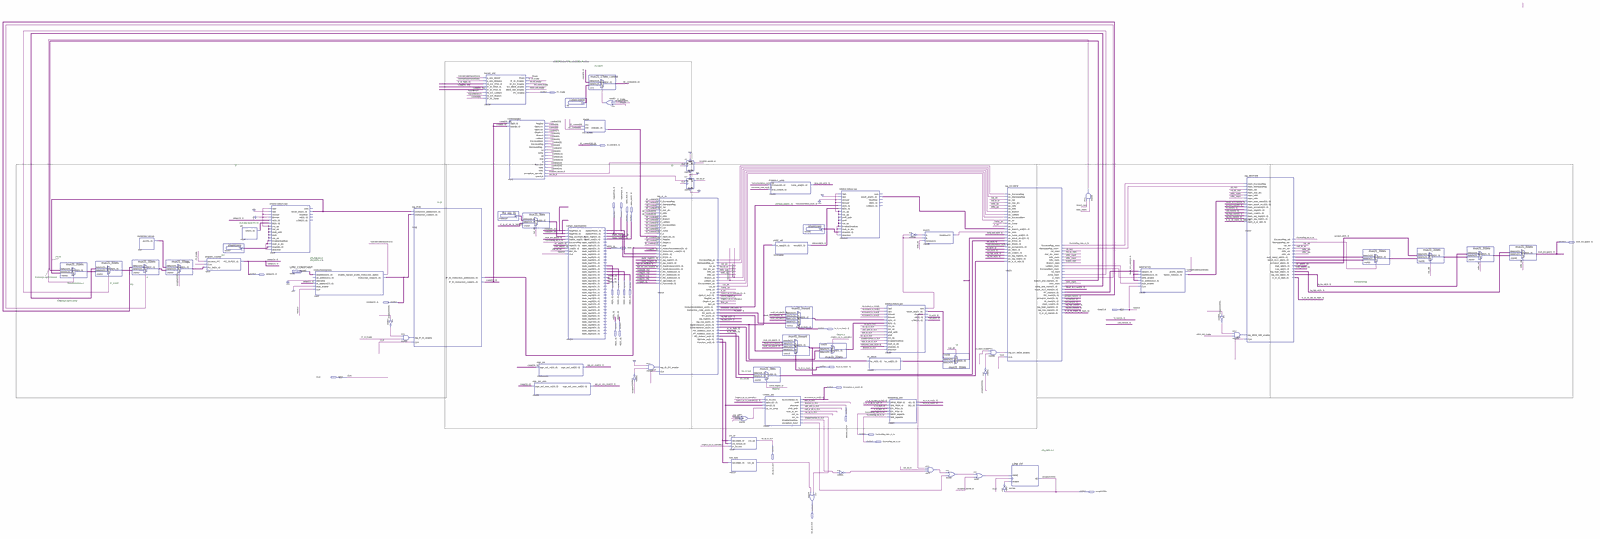
[diagram p0: schematic sheet, whole]
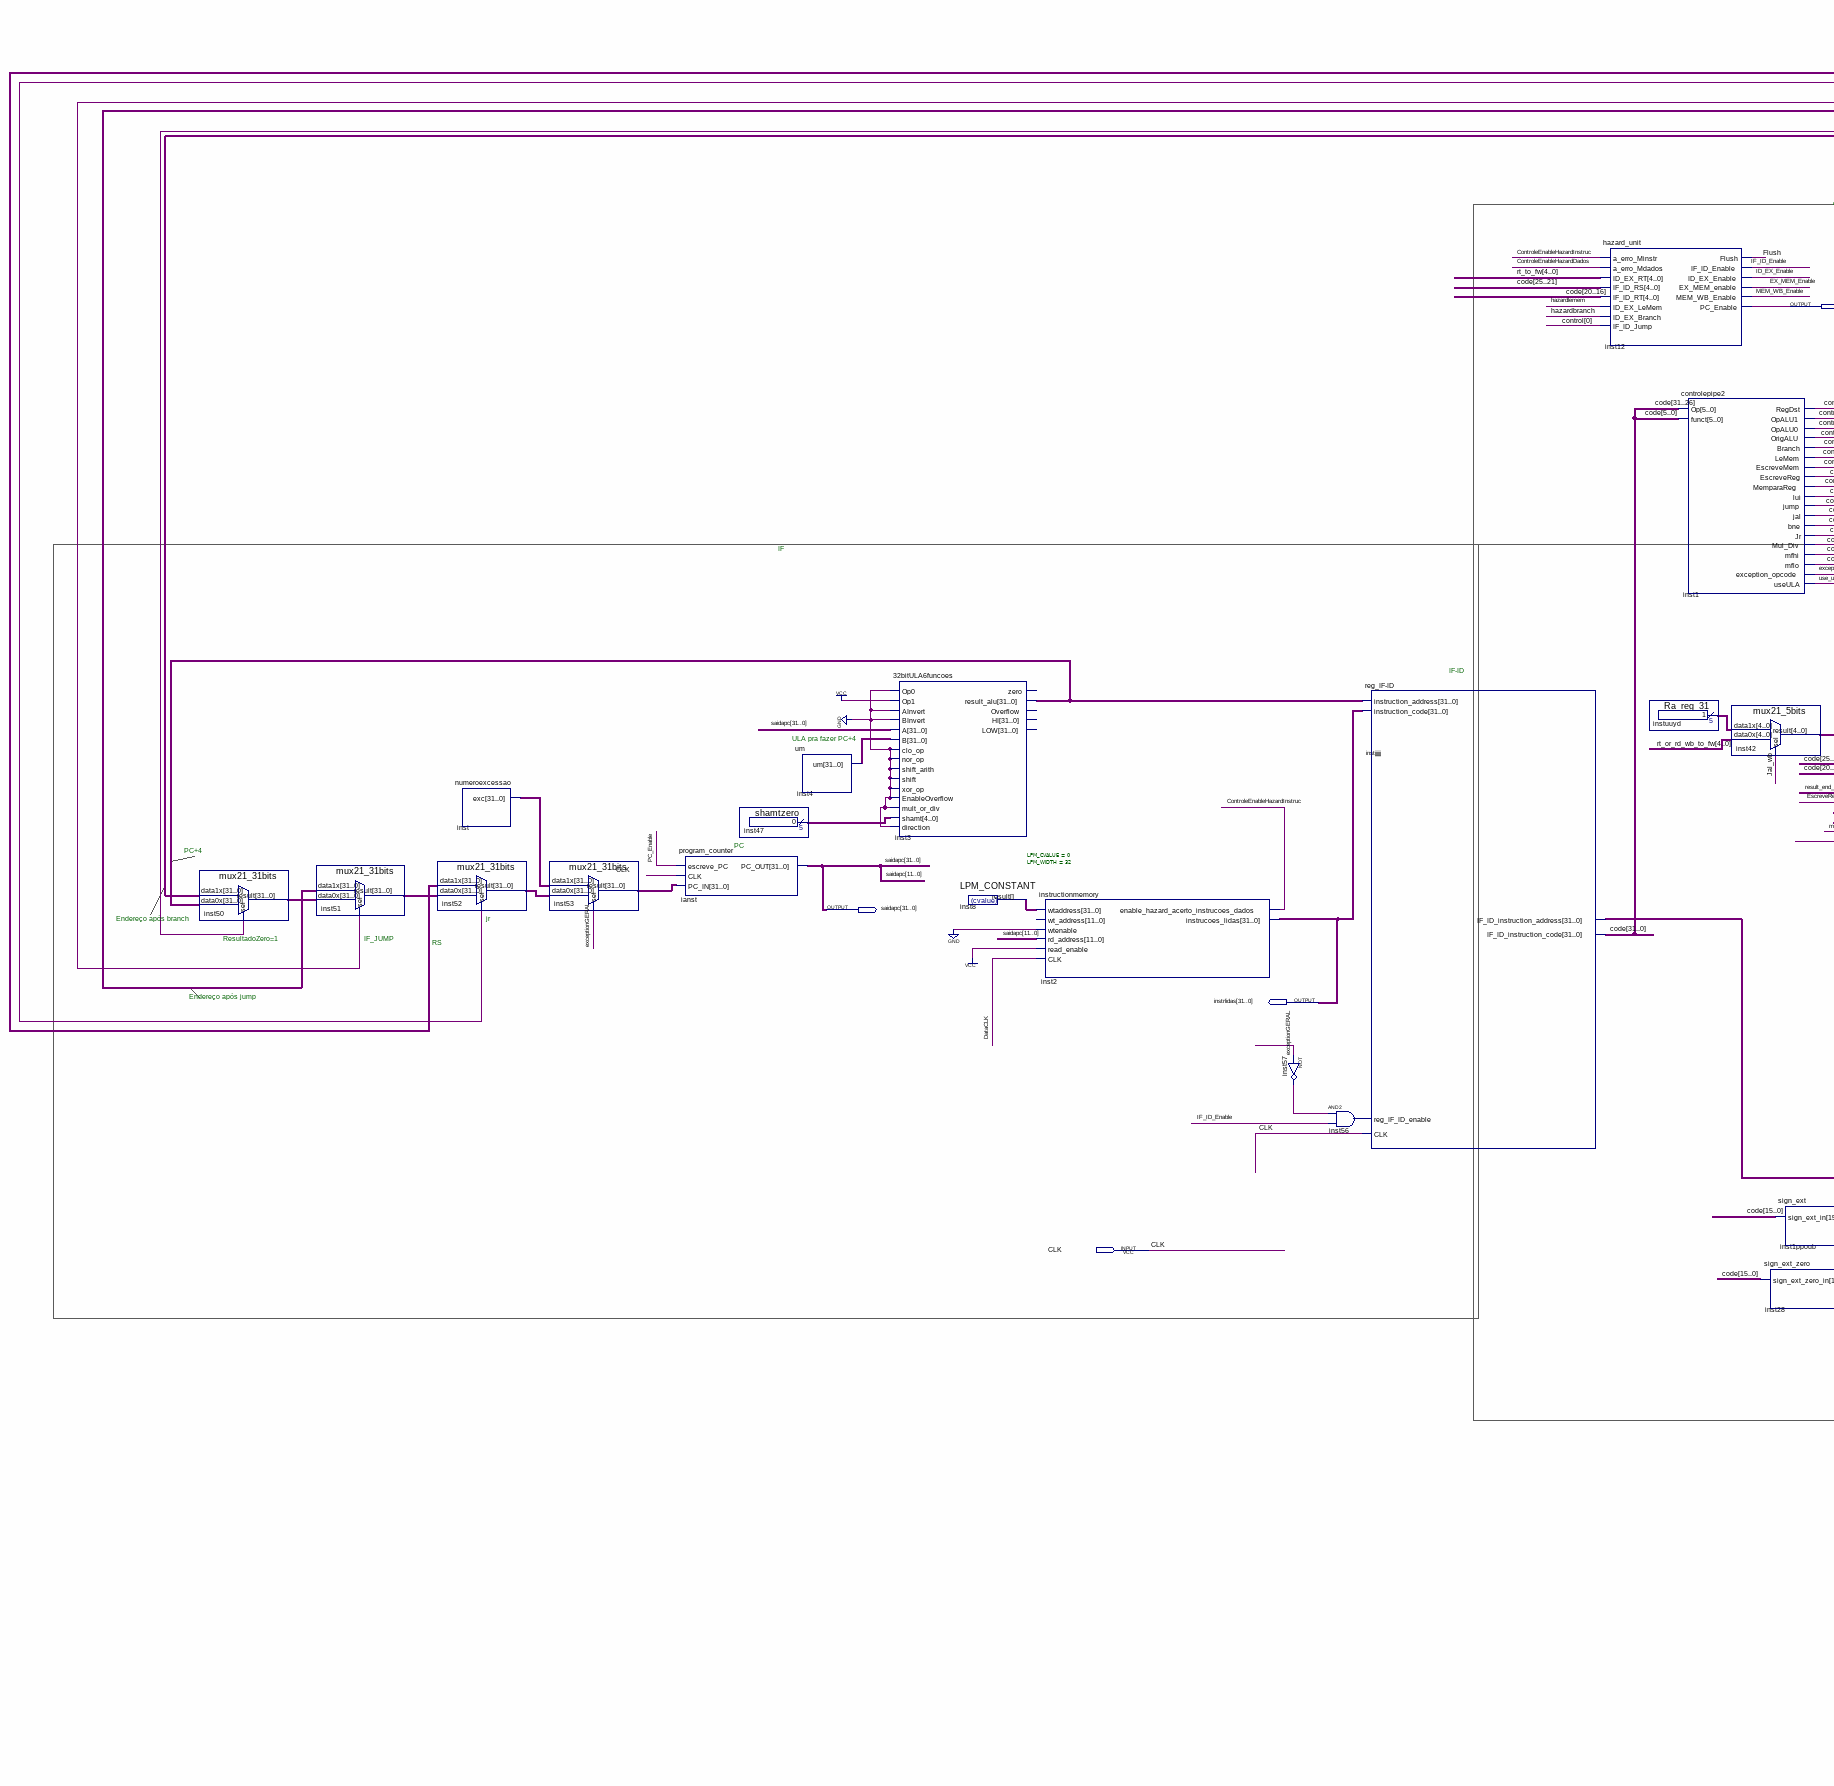
[diagram p1: schematic sheet, left part]
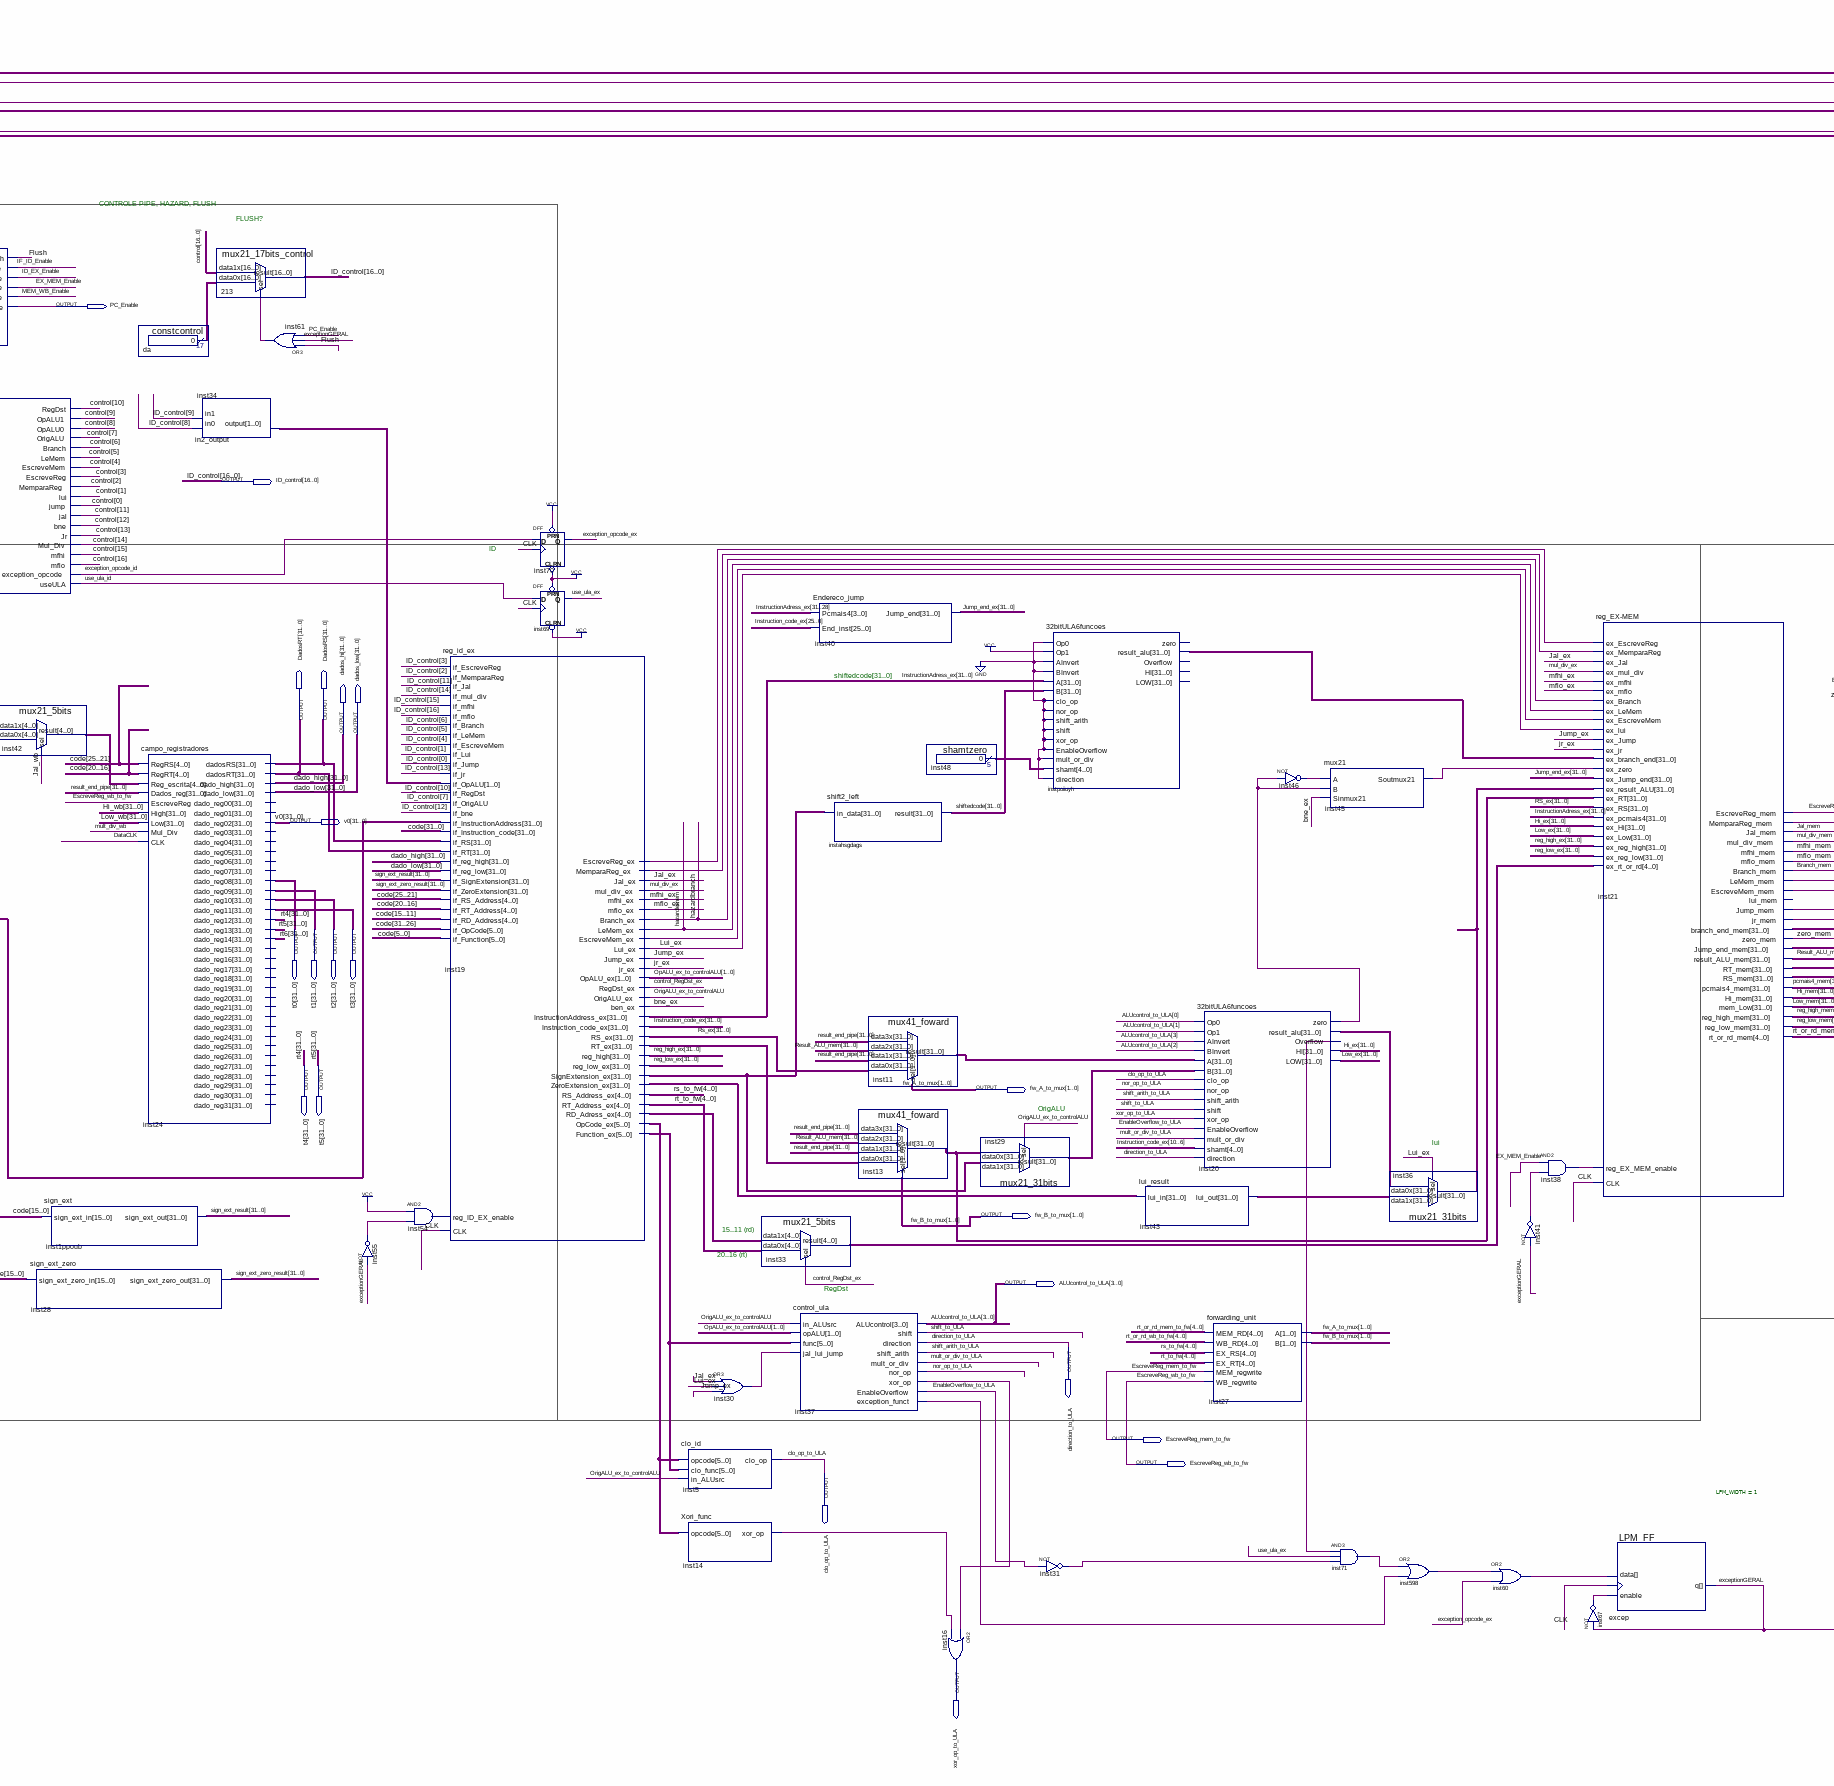
[diagram p2: schematic sheet, centre part]
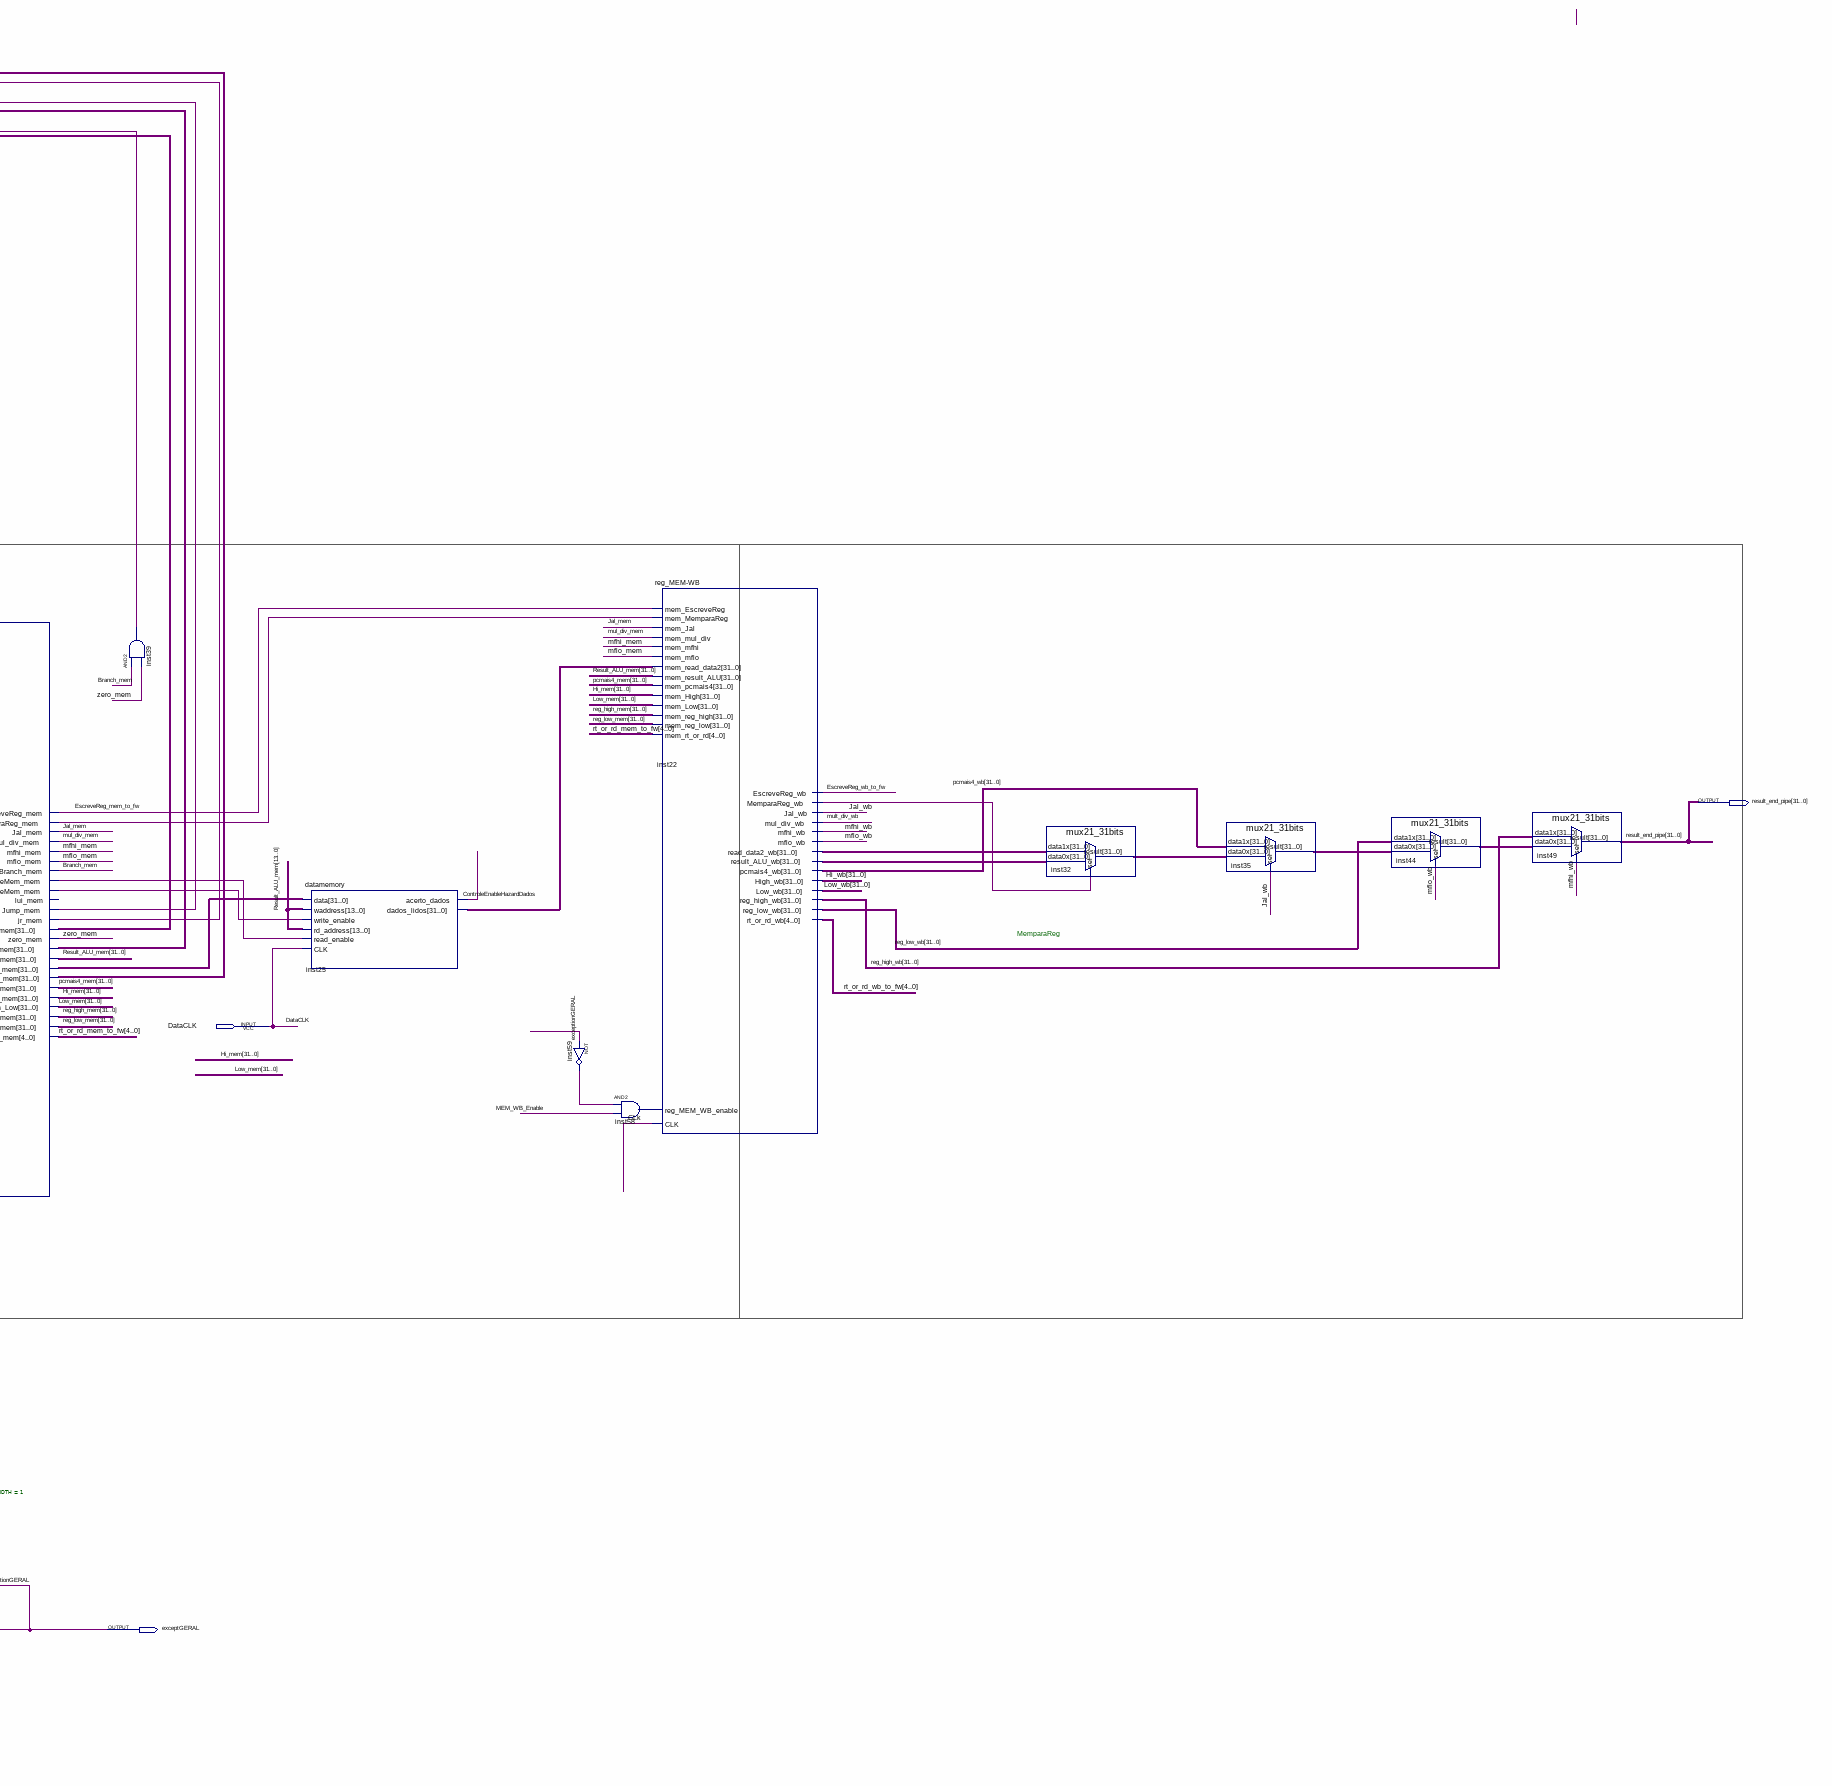
[diagram p3: schematic sheet, right part]
// Quartus schematic oac2.bdf as structural Verilog: 67 symbols, 27 pins
module oac2 (
  input  DataCLK,
  input  CLK,
  output PC_Enable,
  output [16:0] ID_control,
  output [31:0] DadosRT,
  output [31:0] DadosRS,
  output [31:0] dados_hi,
  output [31:0] dados_low,
  output [31:0] result_end_pipe,
  output [31:0] v0,
  output [31:0] saidapc,
  output [31:0] t0,
  output [31:0] t1,
  output [31:0] t2,
  output [31:0] t3,
  output [31:0] instrlidas,
  output [31:0] t4,
  output [31:0] t5,
  output [1:0] fw_A_to_mux,
  output [1:0] fw_B_to_mux,
  output [3:0] ALUcontrol_to_ULA,
  output direction_to_ULA,
  output EscreveReg_mem_to_fw,
  output EscreveReg_wb_to_fw,
  output clo_op_to_ULA,
  output exceptGERAL,
  output xor_op_to_ULA
);

  wire bne_ex, Branch_mem, control_RegDst_ex, ControleEnableHazardDados, ControleEnableHazardInstruc,
       EnableOverflow_to_ULA, EX_MEM_Enable, exception_opcode_ex, exception_opcode_id, Flush, hazardbranch,
       hazardlemem, ID_EX_Enable, IF_ID_Enable, inst14_xor_op, inst19_escrevemem_ex, inst19_escrevereg_ex,
       inst19_memparareg_ex, inst20_overflow, inst20_zero, inst21_escrevemem_mem, inst21_jr_mem,
       inst21_jump_mem, inst21_lemem_mem, inst21_memparareg_mem, inst22_memparareg_wb, inst30_out,
       inst31_out, inst37_exception_funct, inst37_xor_op, inst38_out, inst39_out, inst41_out,
       inst45_soutmux21, inst46_out, inst55_out, inst57_out, inst58_out, inst59_out, inst60_out, inst61_out,
       inst67_out, inst71_out, inst598_out, Jal_ex, Jal_mem, Jal_wb, jr_ex, Jump_ex, Lui_ex, MEM_WB_Enable,
       mfhi_ex, mfhi_mem, mfhi_wb, mflo_ex, mflo_mem, mflo_wb, mul_div_ex, mul_div_mem, mult_div_wb,
       mult_or_div_to_ULA, nor_op_to_ULA, OrigALU_ex_to_controlALU, shift_arith_to_ULA, shift_to_ULA,
       use_ula_ex, use_ula_id, zero_mem;
  wire [1:0] inst34_output, OpALU_ex_to_controlALU;
  wire [4:0] inst19_rd_adress_ex, inst33_result, inst42_result, inst47_result, inst48_result,
       instuuyd_result, rs_to_fw, rt_or_rd_mem_to_fw, rt_or_rd_wb_to_fw, rt_to_fw;
  wire [5:0] inst19_function_ex, inst19_opcode_ex;
  wire [16:0] control, da_result;
  wire [31:0] code, Hi_ex, Hi_mem, Hi_wb, inst3_result_alu, inst4_um, inst8_result, inst11_result,
       inst13_result, inst19_rt_ex, inst19_signextension_ex, inst19_zeroextension_ex, inst20_result_alu,
       inst21_branch_end_mem, inst21_jump_end_mem, inst21_rs_mem, inst21_rt_mem, inst22_read_data2_wb,
       inst22_result_alu_wb, inst25_dados_lidos, inst29_result, inst32_result, inst35_result, inst36_result,
       inst43_lui_out, inst44_result, inst50_result, inst51_result, inst52_result, inst53_result, inst_exc,
       instjjjjjj_if_id_instruction_address, instpoiiuyh_result_alu, Instruction_code_ex,
       InstructionAdress_ex, Jump_end_ex, Low_ex, Low_mem, Low_wb, pcmais4_mem, pcmais4_wb, reg_high_ex,
       reg_high_mem, reg_high_wb, reg_low_ex, reg_low_mem, reg_low_wb, Result_ALU_mem, RS_ex, rt6,
       shiftedcode, sign_ext_result, sign_ext_zero_result;

  mux21_31bits inst50 (
    .data1x(inst21_branch_end_mem), .data0x(inst3_result_alu), .sel(inst39_out), .result(inst50_result));
  mux21_31bits inst51 (
    .data1x(inst21_jump_end_mem), .data0x(inst50_result), .sel(inst21_jump_mem), .result(inst51_result));
  numeroexcessao inst (.exc(inst_exc));
  mux21_31bits inst52 (.data1x(inst21_rs_mem), .data0x(inst51_result), .sel(inst21_jr_mem), .result(inst52_result));
  mux21_31bits inst53 (.data1x(inst_exc), .data0x(inst52_result), .sel(exceptGERAL), .result(inst53_result));
  program_counter ianst (.escreve_PC(PC_Enable), .CLK(CLK), .PC_IN(inst53_result), .PC_OUT(saidapc));
  shamtzero inst47 (.result(inst47_result));
  um inst4 (.um(inst4_um));
  \32bitULA6funcoes  inst3 (
    .Op0(1'b0), .Op1(1'b1), .AInvert(1'b0), .BInvert(1'b0), .A(saidapc), .B(inst4_um), .clo_op(1'b0),
    .nor_op(1'b0), .shift_arith(1'b0), .shift(1'b0), .xor_op(1'b0), .EnableOverflow(1'b0),
    .mult_or_div(1'b0), .shamt(inst47_result), .direction(1'b0), .result_alu(inst3_result_alu));  // open: zero, Overflow, HI, LOW
  LPM_CONSTANT #(.LPM_CVALUE(0), .LPM_WIDTH(32)) inst8 (.result(inst8_result));
  instructionmemory inst2 (
    .wtaddress(inst8_result), .wtenable(1'b0), .rd_address(saidapc[11:0]), .read_enable(1'b1), .CLK(DataCLK),
    .enable_hazard_acerto_instrucoes_dados(ControleEnableHazardInstruc), .instrucoes_lidas(instrlidas));  // open: wt_address
  not inst57 (inst57_out, exceptGERAL);
  // AND2 inst56 has open pins: IN1=inst57_out, IN2=IF_ID_Enable, OUT=open
  \reg_IF-ID  instjjjjjj (
    .instruction_address(inst3_result_alu), .instruction_code(instrlidas), .CLK(CLK),
    .IF_ID_instruction_address(instjjjjjj_if_id_instruction_address), .IF_ID_instruction_code(code));  // open: reg_IF_ID_enable
  hazard_unit inst12 (
    .a_erro_Minstr(ControleEnableHazardInstruc), .a_erro_Mdados(ControleEnableHazardDados),
    .ID_EX_RT(rt_to_fw), .IF_ID_RS(code[25:21]), .IF_ID_RT(code[20:16]), .ID_EX_LeMem(hazardlemem),
    .ID_EX_Branch(hazardbranch), .IF_ID_Jump(control[0]), .Flush(Flush), .IF_ID_Enable(IF_ID_Enable),
    .ID_EX_Enable(ID_EX_Enable), .EX_MEM_enable(EX_MEM_Enable), .MEM_WB_Enable(MEM_WB_Enable),
    .PC_Enable(PC_Enable));
  Ra_reg_31 instuuyd (.result(instuuyd_result));
  controlepipe2 inst1 (
    .Op(code[31:26]), .funct(code[5:0]), .RegDst(control[10]), .OpALU1(control[9]), .OpALU0(control[8]),
    .OrigALU(control[7]), .Branch(control[6]), .LeMem(control[5]), .EscreveMem(control[4]),
    .EscreveReg(control[3]), .MemparaReg(control[2]), .lui(control[1]), .jump(control[0]), .jal(control[11]),
    .bne(control[12]), .Jr(control[13]), .Mul_Div(control[14]), .mfhi(control[15]), .mflo(control[16]),
    .exception_opcode(exception_opcode_id), .useULA(use_ula_id));
  mux21_5bits inst42 (.data1x(instuuyd_result), .data0x(rt_or_rd_wb_to_fw), .sel(Jal_wb), .result(inst42_result));
  sign_ext inst1ppoub (.sign_ext_in(code[15:0]), .sign_ext_out(sign_ext_result));
  sign_ext_zero inst28 (.sign_ext_zero_in(code[15:0]), .sign_ext_zero_out(sign_ext_zero_result));
  constcontrol da (.result(da_result));
  campo_registradores inst24 (
    .RegRS(code[25:21]), .RegRT(code[20:16]), .Reg_escrita(inst42_result), .Dados_reg(result_end_pipe),
    .EscreveReg(EscreveReg_wb_to_fw), .High(Hi_wb), .Low(Low_wb), .Mul_Div(mult_div_wb), .CLK(DataCLK),
    .dadosRS(DadosRS), .dadosRT(DadosRT), .dado_high(dados_hi), .dado_low(dados_low), .dado_reg02(v0),
    .dado_reg08(t0), .dado_reg09(t1), .dado_reg10(t2), .dado_reg11(t3), .dado_reg12(t4), .dado_reg13(t5),
    .dado_reg14(rt6));  // open: dado_reg00, dado_reg01, dado_reg03, dado_reg04, dado_reg05, dado_reg06, dado_reg07, dado_reg15, dado_reg16, dado_reg17, dado_reg18, dado_reg19, dado_reg20, dado_reg21, dado_reg22, dado_reg23, dado_reg24, dado_reg25, dado_reg26, dado_reg27, dado_reg28, dado_reg29, dado_reg30, dado_reg31
  in2_output inst34 (.in0(ID_control[8]), .in1(ID_control[9]), .\output (inst34_output));
  mux21_17bits_control u_213 (.data1x(control), .data0x(da_result), .sel(inst61_out), .result(ID_control));
  or inst61 (inst61_out, Flush, exceptGERAL, PC_Enable);
  not inst55 (inst55_out, exceptGERAL);
  // AND2 inst54 has open pins: IN1=1'b1, IN2=inst55_out, OUT=open
  reg_id_ex inst19 (
    .if_EscreveReg(ID_control[3]), .if_MemparaReg(ID_control[2]), .if_Jal(ID_control[11]),
    .if_mul_div(ID_control[14]), .if_mfhi(ID_control[15]), .if_mflo(ID_control[16]),
    .if_Branch(ID_control[6]), .if_LeMem(ID_control[5]), .if_EscreveMem(ID_control[4]),
    .if_Lui(ID_control[1]), .if_Jump(ID_control[0]), .if_jr(ID_control[13]), .if_OpALU(inst34_output),
    .if_RegDst(ID_control[10]), .if_OrigALU(ID_control[7]), .if_bne(ID_control[12]),
    .if_InstructionAddress(instjjjjjj_if_id_instruction_address), .if_Instruction_code(code),
    .if_RS(DadosRS), .if_RT(DadosRT), .if_reg_high(dados_hi), .if_reg_low(dados_low),
    .if_SignExtension(sign_ext_result), .if_ZeroExtension(sign_ext_zero_result), .if_RS_Address(code[25:21]),
    .if_RT_Address(code[20:16]), .if_RD_Address(code[15:11]), .if_OpCode(code[31:26]),
    .if_Function(code[5:0]), .CLK(CLK), .EscreveReg_ex(inst19_escrevereg_ex),
    .MemparaReg_ex(inst19_memparareg_ex), .Jal_ex(Jal_ex), .mul_div_ex(mul_div_ex), .mfhi_ex(mfhi_ex),
    .mflo_ex(mflo_ex), .Branch_ex(hazardbranch), .LeMem_ex(hazardlemem),
    .EscreveMem_ex(inst19_escrevemem_ex), .Lui_ex(Lui_ex), .Jump_ex(Jump_ex), .jr_ex(jr_ex),
    .OpALU_ex(OpALU_ex_to_controlALU), .RegDst_ex(control_RegDst_ex), .OrigALU_ex(OrigALU_ex_to_controlALU),
    .ben_ex(bne_ex), .InstructionAddress_ex(InstructionAdress_ex), .Instruction_code_ex(Instruction_code_ex),
    .RS_ex(RS_ex), .RT_ex(inst19_rt_ex), .reg_high(reg_high_ex), .reg_low_ex(reg_low_ex),
    .SignExtension_ex(inst19_signextension_ex), .ZeroExtension_ex(inst19_zeroextension_ex),
    .RS_Address_ex(rs_to_fw), .RT_Address_ex(rt_to_fw), .RD_Adress_ex(inst19_rd_adress_ex),
    .OpCode_ex(inst19_opcode_ex), .Function_ex(inst19_function_ex));  // open: reg_ID_EX_enable
  DFF inst70 (.CLRN(1'b1), .CLK(CLK), .D(exception_opcode_id), .PRN(1'b1), .Q(exception_opcode_ex));
  DFF inst69 (.CLRN(1'b1), .CLK(CLK), .D(use_ula_id), .PRN(1'b1), .Q(use_ula_ex));
  clo_id inst5 (
    .opcode(inst19_opcode_ex), .clo_func(inst19_function_ex), .in_ALUsrc(OrigALU_ex_to_controlALU),
    .clo_op(clo_op_to_ULA));
  Xori_func inst14 (.opcode(inst19_opcode_ex), .xor_op(inst14_xor_op));
  or inst30 (inst30_out, Jal_ex, Lui_ex, Jump_ex);
  mux21_5bits inst33 (.data1x(inst19_rd_adress_ex), .data0x(rt_to_fw), .sel(control_RegDst_ex), .result(inst33_result));
  Endereco_jump inst40 (
    .End_inst(Instruction_code_ex[25:0]), .Pcmais4(InstructionAdress_ex[31:28]), .Jump_end(Jump_end_ex));
  control_ula inst37 (
    .in_ALUsrc(OrigALU_ex_to_controlALU), .opALU(OpALU_ex_to_controlALU), .func(inst19_function_ex),
    .jal_lui_jump(inst30_out), .ALUcontrol(ALUcontrol_to_ULA), .shift(shift_to_ULA),
    .direction(direction_to_ULA), .shift_arith(shift_arith_to_ULA), .mult_or_div(mult_or_div_to_ULA),
    .nor_op(nor_op_to_ULA), .xor_op(inst37_xor_op), .EnableOverflow(EnableOverflow_to_ULA),
    .exception_funct(inst37_exception_funct));
  shift2_left instahsgdags (.in_data(inst19_signextension_ex), .result(shiftedcode));
  mux41_foward inst13 (
    .data3x(result_end_pipe), .data2x(Result_ALU_mem), .data1x(result_end_pipe), .data0x(inst19_rt_ex),
    .sel(fw_B_to_mux), .result(inst13_result));
  mux41_foward inst11 (
    .data3x(result_end_pipe), .data2x(Result_ALU_mem), .data1x(result_end_pipe), .data0x(RS_ex),
    .sel(fw_A_to_mux), .result(inst11_result));
  shamtzero inst48 (.result(inst48_result));
  or inst16 (xor_op_to_ULA, inst37_xor_op, inst14_xor_op);
  mux21_31bits inst29 (
    .data1x(inst19_signextension_ex), .data0x(inst13_result), .sel(OrigALU_ex_to_controlALU),
    .result(inst29_result));
  \32bitULA6funcoes  instpoiiuyh (
    .Op0(1'b0), .Op1(1'b1), .AInvert(1'b0), .BInvert(1'b0), .A(InstructionAdress_ex), .B(shiftedcode),
    .clo_op(1'b0), .nor_op(1'b0), .shift_arith(1'b0), .shift(1'b0), .xor_op(1'b0), .EnableOverflow(1'b0),
    .mult_or_div(1'b0), .shamt(inst48_result), .direction(1'b0), .result_alu(instpoiiuyh_result_alu));  // open: zero, Overflow, HI, LOW
  not inst31 (inst31_out, EnableOverflow_to_ULA);
  lui_result inst43 (.lui_in(inst19_zeroextension_ex), .lui_out(inst43_lui_out));
  \32bitULA6funcoes  inst20 (
    .Op0(ALUcontrol_to_ULA[0]), .Op1(ALUcontrol_to_ULA[1]), .AInvert(ALUcontrol_to_ULA[3]),
    .BInvert(ALUcontrol_to_ULA[2]), .A(inst11_result), .B(inst29_result), .clo_op(clo_op_to_ULA),
    .nor_op(nor_op_to_ULA), .shift_arith(shift_arith_to_ULA), .shift(shift_to_ULA), .xor_op(xor_op_to_ULA),
    .EnableOverflow(EnableOverflow_to_ULA), .mult_or_div(mult_or_div_to_ULA),
    .shamt(Instruction_code_ex[10:6]), .direction(direction_to_ULA), .zero(inst20_zero),
    .result_alu(inst20_result_alu), .Overflow(inst20_overflow), .HI(Hi_ex), .LOW(Low_ex));
  forwarding_unit inst27 (
    .MEM_RD(rt_or_rd_mem_to_fw), .WB_RD(rt_or_rd_wb_to_fw), .EX_RS(rs_to_fw), .EX_RT(rt_to_fw),
    .MEM_regwrite(EscreveReg_mem_to_fw), .WB_regwrite(EscreveReg_wb_to_fw), .A(fw_A_to_mux), .B(fw_B_to_mux));
  not inst46 (inst46_out, inst20_zero);
  mux21 inst45 (.A(inst46_out), .B(inst20_zero), .Sinmux21(bne_ex), .Soutmux21(inst45_soutmux21));
  and inst71 (inst71_out, inst20_overflow, use_ula_ex, inst31_out);
  mux21_31bits inst36 (.data1x(inst43_lui_out), .data0x(inst20_result_alu), .sel(Lui_ex), .result(inst36_result));
  or inst598 (inst598_out, inst71_out, inst37_exception_funct);
  not inst41 (inst41_out, exceptGERAL);
  or inst60 (inst60_out, inst598_out, exception_opcode_ex);
  and inst38 (inst38_out, EX_MEM_Enable, inst41_out);
  \reg_EX-MEM  inst21 (
    .reg_EX_MEM_enable(inst38_out), .ex_EscreveReg(inst19_escrevereg_ex),
    .ex_MemparaReg(inst19_memparareg_ex), .ex_Jal(Jal_ex), .ex_mul_div(mul_div_ex), .ex_mfhi(mfhi_ex),
    .ex_mflo(mflo_ex), .ex_Branch(hazardbranch), .ex_LeMem(hazardlemem),
    .ex_EscreveMem(inst19_escrevemem_ex), .ex_lui(Lui_ex), .ex_Jump(Jump_ex), .ex_jr(jr_ex),
    .ex_branch_end(instpoiiuyh_result_alu), .ex_zero(inst45_soutmux21), .ex_Jump_end(Jump_end_ex),
    .ex_result_ALU(inst36_result), .ex_RT(inst13_result), .ex_RS(RS_ex), .ex_pcmais4(InstructionAdress_ex),
    .ex_Hi(Hi_ex), .ex_Low(Low_ex), .ex_reg_high(reg_high_ex), .ex_reg_low(reg_low_ex),
    .ex_rt_or_rd(inst33_result), .CLK(CLK), .EscreveReg_mem(EscreveReg_mem_to_fw),
    .MemparaReg_mem(inst21_memparareg_mem), .Jal_mem(Jal_mem), .mul_div_mem(mul_div_mem),
    .mfhi_mem(mfhi_mem), .mflo_mem(mflo_mem), .Branch_mem(Branch_mem), .LeMem_mem(inst21_lemem_mem),
    .EscreveMem_mem(inst21_escrevemem_mem), .Jump_mem(inst21_jump_mem), .jr_mem(inst21_jr_mem),
    .branch_end_mem(inst21_branch_end_mem), .zero_mem(zero_mem), .Jump_end_mem(inst21_jump_end_mem),
    .result_ALU_mem(Result_ALU_mem), .RT_mem(inst21_rt_mem), .RS_mem(inst21_rs_mem),
    .pcmais4_mem(pcmais4_mem), .Hi_mem(Hi_mem), .mem_Low(Low_mem), .reg_high_mem(reg_high_mem),
    .reg_low_mem(reg_low_mem), .rt_or_rd_mem(rt_or_rd_mem_to_fw));  // open: lui_mem
  not inst67 (inst67_out, exceptGERAL);
  LPM_FF #(.LPM_WIDTH(1)) excep (.enable(inst67_out), .clock(CLK), .data(inst60_out), .q(exceptGERAL));
  and inst39 (inst39_out, Branch_mem, zero_mem);
  datamemory inst25 (
    .data(inst21_rt_mem), .waddress(Result_ALU_mem[13:0]), .write_enable(inst21_escrevemem_mem),
    .rd_address(Result_ALU_mem[13:0]), .read_enable(inst21_lemem_mem), .CLK(DataCLK),
    .acerto_dados(ControleEnableHazardDados), .dados_lidos(inst25_dados_lidos));
  not inst59 (inst59_out, exceptGERAL);
  and inst58 (inst58_out, inst59_out, MEM_WB_Enable);
  \reg_MEM-WB  inst22 (
    .reg_MEM_WB_enable(inst58_out), .mem_EscreveReg(EscreveReg_mem_to_fw),
    .mem_MemparaReg(inst21_memparareg_mem), .mem_Jal(Jal_mem), .mem_mul_div(mul_div_mem),
    .mem_mfhi(mfhi_mem), .mem_mflo(mflo_mem), .mem_read_data2(inst25_dados_lidos),
    .mem_result_ALU(Result_ALU_mem), .mem_pcmais4(pcmais4_mem), .mem_High(Hi_mem), .mem_Low(Low_mem),
    .mem_reg_high(reg_high_mem), .mem_reg_low(reg_low_mem), .mem_rt_or_rd(rt_or_rd_mem_to_fw), .CLK(CLK),
    .EscreveReg_wb(EscreveReg_wb_to_fw), .MemparaReg_wb(inst22_memparareg_wb), .Jal_wb(Jal_wb),
    .mul_div_wb(mult_div_wb), .mfhi_wb(mfhi_wb), .mflo_wb(mflo_wb), .read_data2_wb(inst22_read_data2_wb),
    .result_ALU_wb(inst22_result_alu_wb), .pcmais4_wb(pcmais4_wb), .High_wb(Hi_wb), .Low_wb(Low_wb),
    .reg_high_wb(reg_high_wb), .reg_low_wb(reg_low_wb), .rt_or_rd_wb(rt_or_rd_wb_to_fw));
  mux21_31bits inst32 (
    .data1x(inst22_read_data2_wb), .data0x(inst22_result_alu_wb), .sel(inst22_memparareg_wb),
    .result(inst32_result));
  mux21_31bits inst35 (.data1x(pcmais4_wb), .data0x(inst32_result), .sel(Jal_wb), .result(inst35_result));
  mux21_31bits inst44 (.data1x(reg_low_wb), .data0x(inst35_result), .sel(mflo_wb), .result(inst44_result));
  mux21_31bits inst49 (.data1x(reg_high_wb), .data0x(inst44_result), .sel(mfhi_wb), .result(result_end_pipe));

  // Other names for the same wires on the sheet: dado_high[31:0] = dados_hi; dado_low[31:0] = dados_low;
  //   exceptionGERAL = exceptGERAL; rt4[31:0] = t4; rt5[31:0] = t5

  // Notes on the sheet:
  //   CONTROLE PIPE, HAZARD, FLUSH
  //   FLUSH?
  //   IF
  //   ID
  //   IF-ID
  //   shiftedcode[31..0]
  //   ULA pra fazer PC+4
  //   PC
  //   PC+4
  //   Endereço após branch
  //   jr
  //   MemparaReg
  //   ResultadoZero=1
  //   IF_JUMP
  //   RS
  //   Endereço após jump
  //   OrigALU
  //   lui
  //   15..11 (rd)
  //   20..16 (rt)
  //   RegDst
endmodule
